# Altium schematic sheet 无人驾驶车ECUV3.SchDoc
size A2
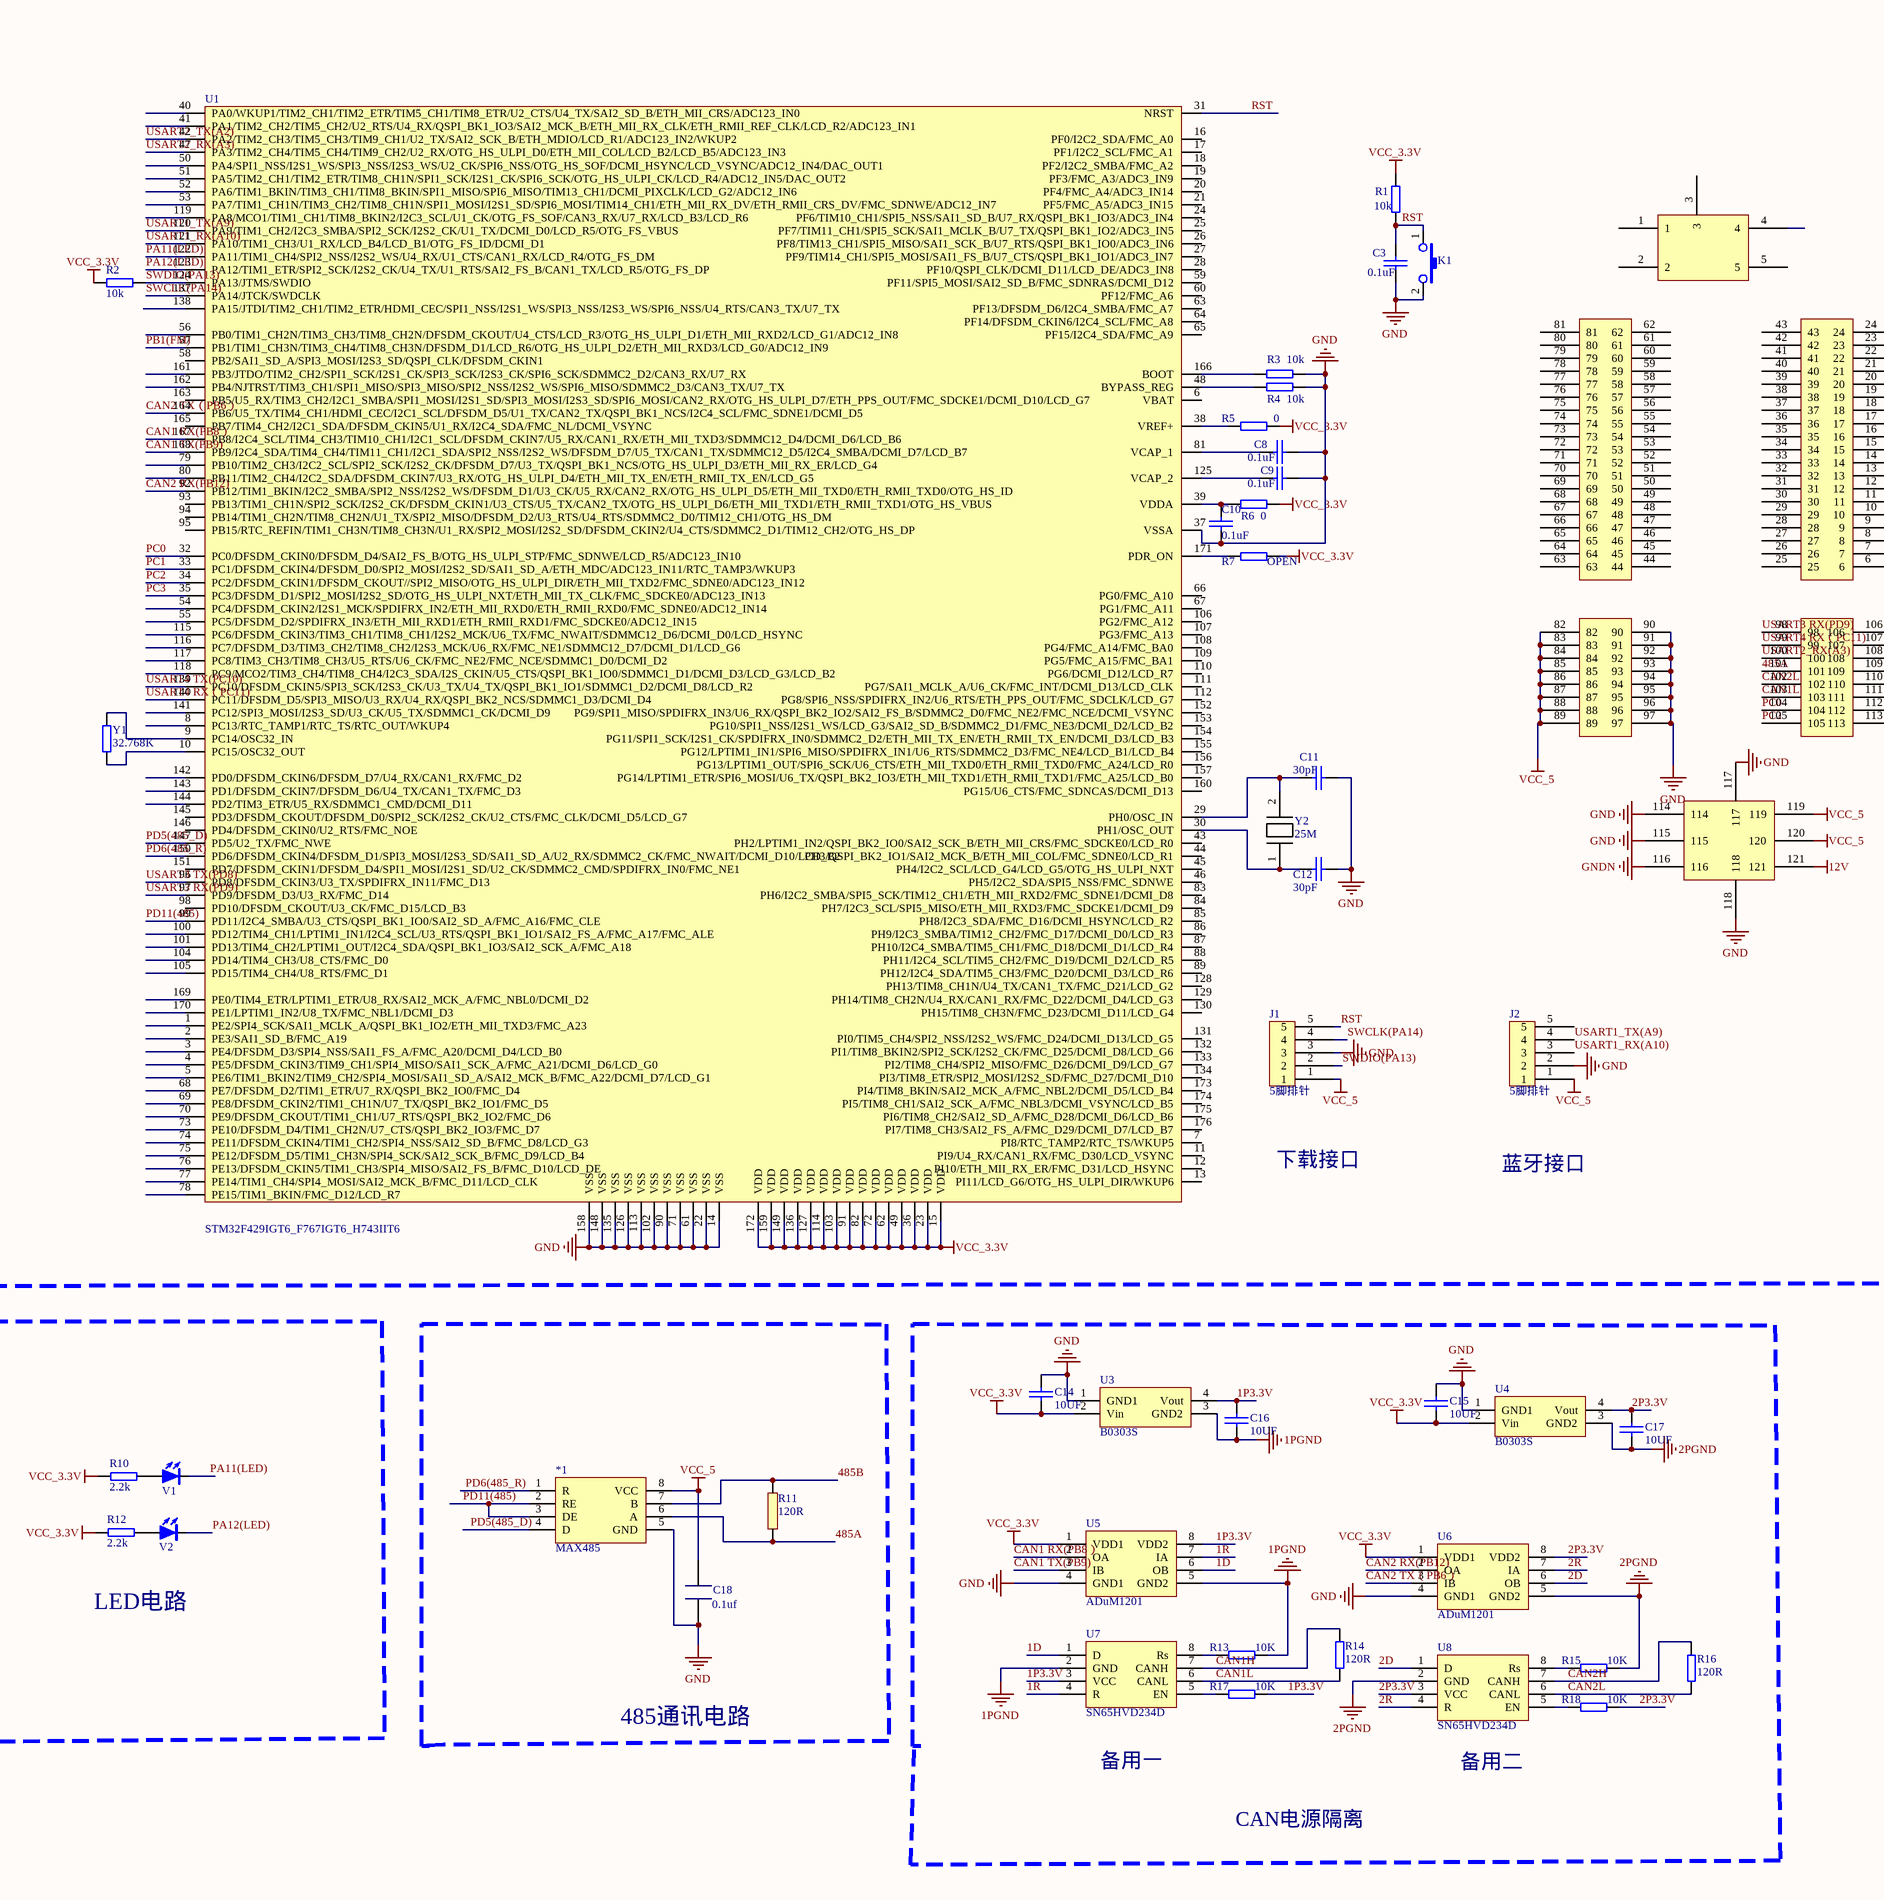
[diagram p0: 无人驾驶车ECUV3.SchDoc, left]
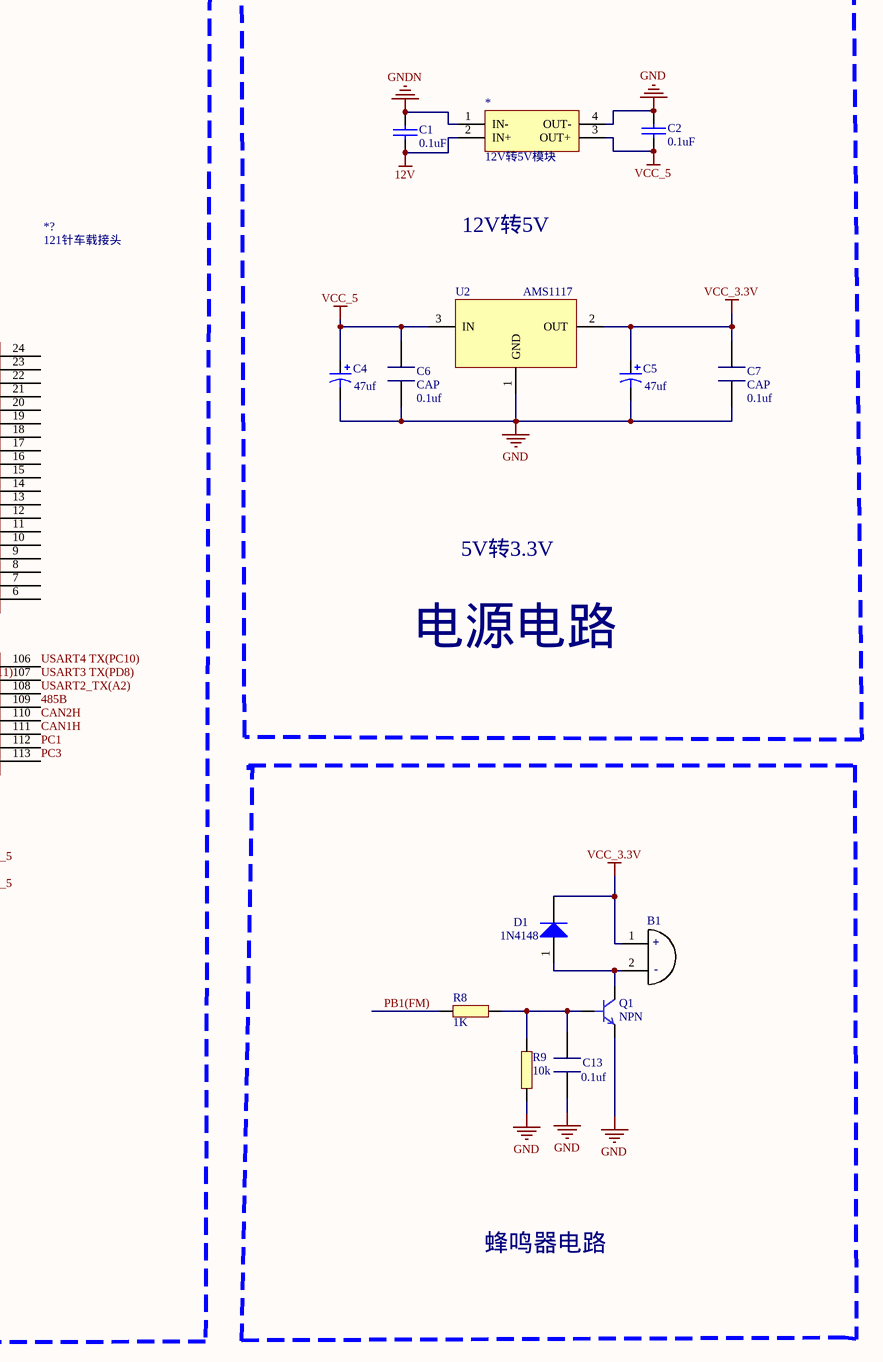
[diagram p1: 无人驾驶车ECUV3.SchDoc, right]

## Parts
*  12V转5V模块  [12V转5V模块]
*1  MAX485  [SOP127P600X175-8N]
*?  121针车载接头  [121针车载接头]
B1  Buzzer  [Buzzer_0905_9*5.5mm]  (value not drawn)
C1  0.1uF  [0805_C_M]
C2  0.1uF  [0805_C_M]
C3  0.1uF  [0805_c_m]
C4  CAP_POL  [CAPC_1206]  (value not drawn)
C5  CAP_POL  [CAPC_1206]  (value not drawn)
C6  CAP  value 0.1uf  [CAPC_0603_2]
C7  CAP  value 0.1uf  [CAPC_0603_2]
C8  0.1uF  [0805_C_M]
C9  0.1uF  [0805_C_M]
C10  0.1uF  [0805_c_m]
C11  30pF  [0805_C_M]
C12  30pF  [0805_C_M]
C13  value 0.1uf  [CAPC_0603_2]  (hidden comment: CAP)
C14  10UF  [SMT_C_0603]
C15  10UF  [SMT_C_0603]
C16  10UF  [SMT_C_0603]
C17  10UF  [SMT_C_0603]
C18  value 0.1uf  [CAPC_0603_2]  (hidden comment: CAP)
D1  1N4148  [SOD_80]
J1  5脚排针  [5脚排针]
J2  5脚排针  [5脚排针]
K1  KEY1  [KEY4]  (value not drawn)
Q1  NPN  [SOT23_3]
R1  10k  [0805_R_M]
R2  10k  [0805_R_M]
R3  10k  [0805_R_M]
R4  10k  [0805_R_M]
R5  0  [0805_R_M]
R6  0  [0805_R_M]
R7  OPEN  [0805_R_M]
R8  value 1K  [RESC_0603_2]  (hidden comment: RES)
R9  value 10k  [RESC_0603_2]  (hidden comment: RES)
R10  2.2k  [0805_R_M]
R11  value 120R  [RESC_0603_2]  (hidden comment: RES)
R12  2.2k  [0805_R_M]
R13  10K  [SMT_R_0402]
R14  120R  [SMT_R_0402]
R15  10K  [SMT_R_0402]
R16  120R  [SMT_R_0402]
R17  10K  [SMT_R_0402]
R18  10K  [SMT_R_0402]
U1  STM32F429IGT6_F767IGT6_H743IIT6  [LQFP176]
U2  AMS1117  [SOT223-AMS1117]
U3  B0303S  [BXXXXS]
U4  B0303S  [BXXXXS]
U5  ADuM1201  [SOP-8_M]
U6  ADuM1201  [SOP-8_M]
U7  SN65HVD234D  [SOP-8_M]
U8  SN65HVD234D  [SOP-8_M]
V1  LED  [0805D]  (value not drawn)
V2  LED  [0805D]  (value not drawn)
Y1  32.768K  [0805_C_M]
Y2  25M  [XTAL_SMD_49S]

## Blocks framed on the sheet
电源电路: * C1 C2 C4-C7 U2

## Nets
1PGND: C16.2 R13.2 U3.3(GND2) U5.5(GND2) U7.2(GND)
2PGND: C17.2 R15.2 U4.3(GND2) U6.5(GND2) U8.2(GND)
12V: *.2(IN+) *?.121 C1.2
GND: *.4(OUT-) *1.5(GND) *?.90 *?.91 *?.92 *?.93 *?.94 *?.95 *?.96 *?.97 *?.114 *?.115 *?.117 *?.118 C2.1 C3.1 C4.2 C5.2 C6.1 C7.1 C8.1 C9.1 C10.2 C11.2 C12.2 C13.1 C14.1 C15.1 C18.1 J1.3 J2.2 K1.2 Q1.2 R3.1 R4.1 R9.1 U1.14(VSS) U1.22(VSS) U1.37(VSSA) U1.61(VSS) U1.71(VSS) U1.90(VSS) U1.102(VSS) U1.113(VSS) U1.126(VSS) U1.135(VSS) U1.148(VSS) U1.158(VSS) U2.1(GND) U3.1(GND1) U4.1(GND1) U5.4(GND1) U6.4(GND1)
GNDN: *.1(IN-) *?.116 C1.1
VCC_3.3V: B1.1 C5.1 C7.2 C14.2 C15.2 D1.2(K) R1.2 R2.2 R5.1 R6.1 R7.1 R10.2 R12.2 U1.15(VDD) U1.23(VDD) U1.36(VDD) U1.49(VDD) U1.62(VDD) U1.72(VDD) U1.82(VDD) U1.91(VDD) U1.103(VDD) U1.114(VDD) U1.127(VDD) U1.136(VDD) U1.149(VDD) U1.159(VDD) U1.172(VDD) U2.2(OUT) U3.2(Vin) U4.2(Vin) U5.1(VDD1) U6.1(VDD1)
VCC_5: *.3(OUT+) *1.8(VCC) *?.82 *?.83 *?.84 *?.85 *?.86 *?.87 *?.88 *?.89 *?.119 *?.120 C2.2 C4.1 C6.2 C18.2 J1.1 J2.1 U2.3(IN)
1D: U5.6(OB) U7.1(D)
1P3.3V: C16.1 R17.2 U3.4(Vout) U5.8(VDD2) U7.3(VCC)
1R: U5.7(IA) U7.4(R)
2D: U6.6(OB) U8.1(D)
2P3.3V: C17.1 R18.2 U4.4(Vout) U6.8(VDD2) U8.3(VCC)
2R: U6.7(IA) U8.4(R)
485A: *1.6(A) *?.101 R11.1
485B: *1.7(B) *?.109 R11.2
CAN1 RX(PB8）: U1.167(PB8/I2C4_SCL/TIM4_CH3/TIM10_CH1/I2C1_SCL/DFSDM_CKIN7/U5_RX/CAN1_RX/ETH_MII_TXD3/SDMMC12_D4/DCMI_D6/LCD_B6) U5.2(OA)
CAN1 TX(PB9): U1.168(PB9/I2C4_SDA/TIM4_CH4/TIM11_CH1/I2C1_SDA/SPI2_NSS/I2S2_WS/DFSDM_D7/U5_TX/CAN1_TX/SDMMC12_D5/I2C4_SMBA/DCMI_D7/LCD_B7) U5.3(IB)
CAN1H: *?.111 R14.2 U7.7(CANH)
CAN1L: *?.103 R14.1 U7.6(CANL)
CAN2 RX(PB12): U1.92(PB12/TIM1_BKIN/I2C2_SMBA/SPI2_NSS/I2S2_WS/DFSDM_D1/U3_CK/U5_RX/CAN2_RX/OTG_HS_ULPI_D5/ETH_MII_TXD0/ETH_RMII_TXD0/OTG_HS_ID) U6.2(OA)
CAN2 TX（PB6）: U1.164(PB6/U5_TX/TIM4_CH1/HDMI_CEC/I2C1_SCL/DFSDM_D5/U1_TX/CAN2_TX/QSPI_BK1_NCS/I2C4_SCL/FMC_SDNE1/DCMI_D5) U6.3(IB)
CAN2H: *?.110 R16.2 U8.7(CANH)
CAN2L: *?.102 R16.1 U8.6(CANL)
PA11(LED): U1.122(PA11/TIM1_CH4/SPI2_NSS/I2S2_WS/U4_RX/U1_CTS/CAN1_RX/LCD_R4/OTG_FS_DM) V1.2
PA12(LED): U1.123(PA12/TIM1_ETR/SPI2_SCK/I2S2_CK/U4_TX/U1_RTS/SAI2_FS_B/CAN1_TX/LCD_R5/OTG_FS_DP) V2.2
PB1(FM): R8.1 U1.57(PB1/TIM1_CH3N/TIM3_CH4/TIM8_CH3N/DFSDM_D1/LCD_R6/OTG_HS_ULPI_D2/ETH_MII_RXD3/LCD_G0/ADC12_IN9)
PC0: *?.104 U1.32(PC0/DFSDM_CKIN0/DFSDM_D4/SAI2_FS_B/OTG_HS_ULPI_STP/FMC_SDNWE/LCD_R5/ADC123_IN10)
PC1: *?.112 U1.33(PC1/DFSDM_CKIN4/DFSDM_D0/SPI2_MOSI/I2S2_SD/SAI1_SD_A/ETH_MDC/ADC123_IN11/RTC_TAMP3/WKUP3)
PC2: *?.105 U1.34(PC2/DFSDM_CKIN1/DFSDM_CKOUT//SPI2_MISO/OTG_HS_ULPI_DIR/ETH_MII_TXD2/FMC_SDNE0/ADC123_IN12)
PC3: *?.113 U1.35(PC3/DFSDM_D1/SPI2_MOSI/I2S2_SD/OTG_HS_ULPI_NXT/ETH_MII_TX_CLK/FMC_SDCKE0/ADC123_IN13)
PD5(485_D): *1.4(D) U1.147(PD5/U2_TX/FMC_NWE)
PD6(485_R): *1.1(R) U1.150(PD6/DFSDM_CKIN4/DFSDM_D1/SPI3_MOSI/I2S3_SD/SAI1_SD_A/U2_RX/SDMMC2_CK/FMC_NWAIT/DCMI_D10/LCD_B2)
PD11(485): *1.2(RE) *1.3(DE) U1.99(PD11/I2C4_SMBA/U3_CTS/QSPI_BK1_IO0/SAI2_SD_A/FMC_A16/FMC_CLE)
RST: C3.2 J1.5 K1.1 R1.1 U1.31(NRST)
SWCLK(PA14): J1.4 U1.137(PA14/JTCK/SWDCLK)
SWDIO(PA13): J1.2 R2.1 U1.124(PA13/JTMS/SWDIO)
USART1_RX(A10): J2.3 U1.121(PA10/TIM1_CH3/U1_RX/LCD_B4/LCD_B1/OTG_FS_ID/DCMI_D1)
USART1_TX(A9): J2.4 U1.120(PA9/TIM1_CH2/I2C3_SMBA/SPI2_SCK/I2S2_CK/U1_TX/DCMI_D0/LCD_R5/OTG_FS_VBUS)
USART2_RX(A3): *?.100 U1.47(PA3/TIM2_CH4/TIM5_CH4/TIM9_CH2/U2_RX/OTG_HS_ULPI_D0/ETH_MII_COL/LCD_B2/LCD_B5/ADC123_IN3)
USART2_TX(A2): *?.108 U1.42(PA2/TIM2_CH3/TIM5_CH3/TIM9_CH1/U2_TX/SAI2_SCK_B/ETH_MDIO/LCD_R1/ADC123_IN2/WKUP2)
USART3 RX(PD9): *?.98 U1.97(PD9/DFSDM_D3/U3_RX/FMC_D14)
USART3 TX(PD8): *?.107 U1.96(PD8/DFSDM_CKIN3/U3_TX/SPDIFRX_IN11/FMC_D13)
USART4 RX（PC11): *?.99 U1.140(PC11/DFSDM_D5/SPI3_MISO/U3_RX/U4_RX/QSPI_BK2_NCS/SDMMC1_D3/DCMI_D4)
USART4 TX(PC10): *?.106 U1.139(PC10/DFSDM_CKIN5/SPI3_SCK/I2S3_CK/U3_TX/U4_TX/QSPI_BK1_IO1/SDMMC1_D2/DCMI_D8/LCD_R2)
NetB1_2: B1.2 D1.1(A) Q1.3
NetC8_2: C8.2 U1.81(VCAP_1)
NetC9_2: C9.2 U1.125(VCAP_2)
NetC10_1: C10.1 R6.2 U1.39(VDDA)
NetC11_1: C11.1 U1.29(PH0/OSC_IN) Y2.2
NetC12_1: C12.1 U1.30(PH1/OSC_OUT) Y2.1
NetC13_2: C13.2 Q1.1 R8.2 R9.2
NetR3_2: R3.2 U1.166(BOOT)
NetR4_2: R4.2 U1.48(BYPASS_REG)
NetR5_2: R5.2 U1.38(VREF+)
NetR7_2: R7.2 U1.171(PDR_ON)
NetR10_1: R10.1 V1.1
NetR12_1: R12.1 V2.1
NetR13_1: R13.1 U7.8(Rs)
NetR15_1: R15.1 U8.8(Rs)
NetR17_1: R17.1 U7.5(EN)
NetR18_1: R18.1 U8.5(EN)
NetU1_9: U1.9(PC14/OSC32_IN) Y1.2
NetU1_10: U1.10(PC15/OSC32_OUT) Y1.1

Not connected (* = marked no-connect by the designer): *? 1 2 3 4 5 6 7 8 9 10 11 12 13 14 15 16 17 18 19 20 21 22 23 24 25 26 27 28 29 30 31 32 33 34 35 36 37 38 39 40 41 42 43 44 45 46 47 48 49 50 51 52 53 54 55 56 57 58 59 60 61 62 63 64 65 66 67 68 69 70 71 72 73 74 75 76 77 78 79 80 81; J2 5; U1 1(PE2/SPI4_SCK/SAI1_MCLK_A/QSPI_BK1_IO2/ETH_MII_TXD3/FMC_A23) 2(PE3/SAI1_SD_B/FMC_A19) 3(PE4/DFSDM_D3/SPI4_NSS/SAI1_FS_A/FMC_A20/DCMI_D4/LCD_B0) 4(PE5/DFSDM_CKIN3/TIM9_CH1/SPI4_MISO/SAI1_SCK_A/FMC_A21/DCMI_D6/LCD_G0) 5(PE6/TIM1_BKIN2/TIM9_CH2/SPI4_MOSI/SAI1_SD_A/SAI2_MCK_B/FMC_A22/DCMI_D7/LCD_G1) 6(VBAT) 7(PI8/RTC_TAMP2/RTC_TS/WKUP5) 8(PC13/RTC_TAMP1/RTC_TS/RTC_OUT/WKUP4) 11(PI9/U4_RX/CAN1_RX/FMC_D30/LCD_VSYNC) 12(PI10/ETH_MII_RX_ER/FMC_D31/LCD_HSYNC) 13(PI11/LCD_G6/OTG_HS_ULPI_DIR/WKUP6) 16(PF0/I2C2_SDA/FMC_A0) 17(PF1/I2C2_SCL/FMC_A1) 18(PF2/I2C2_SMBA/FMC_A2) 19(PF3/FMC_A3/ADC3_IN9) 20(PF4/FMC_A4/ADC3_IN14) 21(PF5/FMC_A5/ADC3_IN15) 24(PF6/TIM10_CH1/SPI5_NSS/SAI1_SD_B/U7_RX/QSPI_BK1_IO3/ADC3_IN4) 25(PF7/TIM11_CH1/SPI5_SCK/SAI1_MCLK_B/U7_TX/QSPI_BK1_IO2/ADC3_IN5) 26(PF8/TIM13_CH1/SPI5_MISO/SAI1_SCK_B/U7_RTS/QSPI_BK1_IO0/ADC3_IN6) 27(PF9/TIM14_CH1/SPI5_MOSI/SAI1_FS_B/U7_CTS/QSPI_BK1_IO1/ADC3_IN7) 28(PF10/QSPI_CLK/DCMI_D11/LCD_DE/ADC3_IN8) 40(PA0/WKUP1/TIM2_CH1/TIM2_ETR/TIM5_CH1/TIM8_ETR/U2_CTS/U4_TX/SAI2_SD_B/ETH_MII_CRS/ADC123_IN0) 41(PA1/TIM2_CH2/TIM5_CH2/U2_RTS/U4_RX/QSPI_BK1_IO3/SAI2_MCK_B/ETH_MII_RX_CLK/ETH_RMII_REF_CLK/LCD_R2/ADC123_IN1) 43(PH2/LPTIM1_IN2/QSPI_BK2_IO0/SAI2_SCK_B/ETH_MII_CRS/FMC_SDCKE0/LCD_R0) 44(PH3/QSPI_BK2_IO1/SAI2_MCK_B/ETH_MII_COL/FMC_SDNE0/LCD_R1) 45(PH4/I2C2_SCL/LCD_G4/LCD_G5/OTG_HS_ULPI_NXT) 46(PH5/I2C2_SDA/SPI5_NSS/FMC_SDNWE) 50(PA4/SPI1_NSS/I2S1_WS/SPI3_NSS/I2S3_WS/U2_CK/SPI6_NSS/OTG_HS_SOF/DCMI_HSYNC/LCD_VSYNC/ADC12_IN4/DAC_OUT1) 51(PA5/TIM2_CH1/TIM2_ETR/TIM8_CH1N/SPI1_SCK/I2S1_CK/SPI6_SCK/OTG_HS_ULPI_CK/LCD_R4/ADC12_IN5/DAC_OUT2) 52(PA6/TIM1_BKIN/TIM3_CH1/TIM8_BKIN/SPI1_MISO/SPI6_MISO/TIM13_CH1/DCMI_PIXCLK/LCD_G2/ADC12_IN6) 53(PA7/TIM1_CH1N/TIM3_CH2/TIM8_CH1N/SPI1_MOSI/I2S1_SD/SPI6_MOSI/TIM14_CH1/ETH_MII_RX_DV/ETH_RMII_CRS_DV/FMC_SDNWE/ADC12_IN7) 54(PC4/DFSDM_CKIN2/I2S1_MCK/SPDIFRX_IN2/ETH_MII_RXD0/ETH_RMII_RXD0/FMC_SDNE0/ADC12_IN14) 55(PC5/DFSDM_D2/SPDIFRX_IN3/ETH_MII_RXD1/ETH_RMII_RXD1/FMC_SDCKE0/ADC12_IN15) 56(PB0/TIM1_CH2N/TIM3_CH3/TIM8_CH2N/DFSDM_CKOUT/U4_CTS/LCD_R3/OTG_HS_ULPI_D1/ETH_MII_RXD2/LCD_G1/ADC12_IN8) 58(PB2/SAI1_SD_A/SPI3_MOSI/I2S3_SD/QSPI_CLK/DFSDM_CKIN1) 59(PF11/SPI5_MOSI/SAI2_SD_B/FMC_SDNRAS/DCMI_D12) 60(PF12/FMC_A6) 63(PF13/DFSDM_D6/I2C4_SMBA/FMC_A7) 64(PF14/DFSDM_CKIN6/I2C4_SCL/FMC_A8) 65(PF15/I2C4_SDA/FMC_A9) 66(PG0/FMC_A10) 67(PG1/FMC_A11) 68(PE7/DFSDM_D2/TIM1_ETR/U7_RX/QSPI_BK2_IO0/FMC_D4) 69(PE8/DFSDM_CKIN2/TIM1_CH1N/U7_TX/QSPI_BK2_IO1/FMC_D5) 70(PE9/DFSDM_CKOUT/TIM1_CH1/U7_RTS/QSPI_BK2_IO2/FMC_D6) 73(PE10/DFSDM_D4/TIM1_CH2N/U7_CTS/QSPI_BK2_IO3/FMC_D7) 74(PE11/DFSDM_CKIN4/TIM1_CH2/SPI4_NSS/SAI2_SD_B/FMC_D8/LCD_G3) 75(PE12/DFSDM_D5/TIM1_CH3N/SPI4_SCK/SAI2_SCK_B/FMC_D9/LCD_B4) 76(PE13/DFSDM_CKIN5/TIM1_CH3/SPI4_MISO/SAI2_FS_B/FMC_D10/LCD_DE) 77(PE14/TIM1_CH4/SPI4_MOSI/SAI2_MCK_B/FMC_D11/LCD_CLK) 78(PE15/TIM1_BKIN/FMC_D12/LCD_R7) 79(PB10/TIM2_CH3/I2C2_SCL/SPI2_SCK/I2S2_CK/DFSDM_D7/U3_TX/QSPI_BK1_NCS/OTG_HS_ULPI_D3/ETH_MII_RX_ER/LCD_G4) 80(PB11/TIM2_CH4/I2C2_SDA/DFSDM_CKIN7/U3_RX/OTG_HS_ULPI_D4/ETH_MII_TX_EN/ETH_RMII_TX_EN/LCD_G5) 83(PH6/I2C2_SMBA/SPI5_SCK/TIM12_CH1/ETH_MII_RXD2/FMC_SDNE1/DCMI_D8) 84(PH7/I2C3_SCL/SPI5_MISO/ETH_MII_RXD3/FMC_SDCKE1/DCMI_D9) 85(PH8/I2C3_SDA/FMC_D16/DCMI_HSYNC/LCD_R2) 86(PH9/I2C3_SMBA/TIM12_CH2/FMC_D17/DCMI_D0/LCD_R3) 87(PH10/I2C4_SMBA/TIM5_CH1/FMC_D18/DCMI_D1/LCD_R4) 88(PH11/I2C4_SCL/TIM5_CH2/FMC_D19/DCMI_D2/LCD_R5) 89(PH12/I2C4_SDA/TIM5_CH3/FMC_D20/DCMI_D3/LCD_R6) 93(PB13/TIM1_CH1N/SPI2_SCK/I2S2_CK/DFSDM_CKIN1/U3_CTS/U5_TX/CAN2_TX/OTG_HS_ULPI_D6/ETH_MII_TXD1/ETH_RMII_TXD1/OTG_HS_VBUS) 94(PB14/TIM1_CH2N/TIM8_CH2N/U1_TX/SPI2_MISO/DFSDM_D2/U3_RTS/U4_RTS/SDMMC2_D0/TIM12_CH1/OTG_HS_DM) 95(PB15/RTC_REFIN/TIM1_CH3N/TIM8_CH3N/U1_RX/SPI2_MOSI/I2S2_SD/DFSDM_CKIN2/U4_CTS/SDMMC2_D1/TIM12_CH2/OTG_HS_DP) 98(PD10/DFSDM_CKOUT/U3_CK/FMC_D15/LCD_B3) 100(PD12/TIM4_CH1/LPTIM1_IN1/I2C4_SCL/U3_RTS/QSPI_BK1_IO1/SAI2_FS_A/FMC_A17/FMC_ALE) 101(PD13/TIM4_CH2/LPTIM1_OUT/I2C4_SDA/QSPI_BK1_IO3/SAI2_SCK_A/FMC_A18) 104(PD14/TIM4_CH3/U8_CTS/FMC_D0) 105(PD15/TIM4_CH4/U8_RTS/FMC_D1) 106(PG2/FMC_A12) 107(PG3/FMC_A13) 108(PG4/FMC_A14/FMC_BA0) 109(PG5/FMC_A15/FMC_BA1) 110(PG6/DCMI_D12/LCD_R7) 111(PG7/SAI1_MCLK_A/U6_CK/FMC_INT/DCMI_D13/LCD_CLK) 112(PG8/SPI6_NSS/SPDIFRX_IN2/U6_RTS/ETH_PPS_OUT/FMC_SDCLK/LCD_G7) 115(PC6/DFSDM_CKIN3/TIM3_CH1/TIM8_CH1/I2S2_MCK/U6_TX/FMC_NWAIT/SDMMC12_D6/DCMI_D0/LCD_HSYNC) 116(PC7/DFSDM_D3/TIM3_CH2/TIM8_CH2/I2S3_MCK/U6_RX/FMC_NE1/SDMMC12_D7/DCMI_D1/LCD_G6) 117(PC8/TIM3_CH3/TIM8_CH3/U5_RTS/U6_CK/FMC_NE2/FMC_NCE/SDMMC1_D0/DCMI_D2) 118(PC9/MCO2/TIM3_CH4/TIM8_CH4/I2C3_SDA/I2S_CKIN/U5_CTS/QSPI_BK1_IO0/SDMMC1_D1/DCMI_D3/LCD_G3/LCD_B2) 119(PA8/MCO1/TIM1_CH1/TIM8_BKIN2/I2C3_SCL/U1_CK/OTG_FS_SOF/CAN3_RX/U7_RX/LCD_B3/LCD_R6) 128(PH13/TIM8_CH1N/U4_TX/CAN1_TX/FMC_D21/LCD_G2) 129(PH14/TIM8_CH2N/U4_RX/CAN1_RX/FMC_D22/DCMI_D4/LCD_G3) 130(PH15/TIM8_CH3N/FMC_D23/DCMI_D11/LCD_G4) 131(PI0/TIM5_CH4/SPI2_NSS/I2S2_WS/FMC_D24/DCMI_D13/LCD_G5) 132(PI1/TIM8_BKIN2/SPI2_SCK/I2S2_CK/FMC_D25/DCMI_D8/LCD_G6) 133(PI2/TIM8_CH4/SPI2_MISO/FMC_D26/DCMI_D9/LCD_G7) 134(PI3/TIM8_ETR/SPI2_MOSI/I2S2_SD/FMC_D27/DCMI_D10) 138(PA15/JTDI/TIM2_CH1/TIM2_ETR/HDMI_CEC/SPI1_NSS/I2S1_WS/SPI3_NSS/I2S3_WS/SPI6_NSS/U4_RTS/CAN3_TX/U7_TX) 141(PC12/SPI3_MOSI/I2S3_SD/U3_CK/U5_TX/SDMMC1_CK/DCMI_D9) 142(PD0/DFSDM_CKIN6/DFSDM_D7/U4_RX/CAN1_RX/FMC_D2) 143(PD1/DFSDM_CKIN7/DFSDM_D6/U4_TX/CAN1_TX/FMC_D3) 144(PD2/TIM3_ETR/U5_RX/SDMMC1_CMD/DCMI_D11) 145(PD3/DFSDM_CKOUT/DFSDM_D0/SPI2_SCK/I2S2_CK/U2_CTS/FMC_CLK/DCMI_D5/LCD_G7) 146(PD4/DFSDM_CKIN0/U2_RTS/FMC_NOE) 151(PD7/DFSDM_CKIN1/DFSDM_D4/SPI1_MOSI/I2S1_SD/U2_CK/SDMMC2_CMD/SPDIFRX_IN0/FMC_NE1) 152(PG9/SPI1_MISO/SPDIFRX_IN3/U6_RX/QSPI_BK2_IO2/SAI2_FS_B/SDMMC2_D0/FMC_NE2/FMC_NCE/DCMI_VSYNC) 153(PG10/SPI1_NSS/I2S1_WS/LCD_G3/SAI2_SD_B/SDMMC2_D1/FMC_NE3/DCMI_D2/LCD_B2) 154(PG11/SPI1_SCK/I2S1_CK/SPDIFRX_IN0/SDMMC2_D2/ETH_MII_TX_EN/ETH_RMII_TX_EN/DCMI_D3/LCD_B3) 155(PG12/LPTIM1_IN1/SPI6_MISO/SPDIFRX_IN1/U6_RTS/SDMMC2_D3/FMC_NE4/LCD_B1/LCD_B4) 156(PG13/LPTIM1_OUT/SPI6_SCK/U6_CTS/ETH_MII_TXD0/ETH_RMII_TXD0/FMC_A24/LCD_R0) 157(PG14/LPTIM1_ETR/SPI6_MOSI/U6_TX/QSPI_BK2_IO3/ETH_MII_TXD1/ETH_RMII_TXD1/FMC_A25/LCD_B0) 160(PG15/U6_CTS/FMC_SDNCAS/DCMI_D13) 161(PB3/JTDO/TIM2_CH2/SPI1_SCK/I2S1_CK/SPI3_SCK/I2S3_CK/SPI6_SCK/SDMMC2_D2/CAN3_RX/U7_RX) 162(PB4/NJTRST/TIM3_CH1/SPI1_MISO/SPI3_MISO/SPI2_NSS/I2S2_WS/SPI6_MISO/SDMMC2_D3/CAN3_TX/U7_TX) 163(PB5/U5_RX/TIM3_CH2/I2C1_SMBA/SPI1_MOSI/I2S1_SD/SPI3_MOSI/I2S3_SD/SPI6_MOSI/CAN2_RX/OTG_HS_ULPI_D7/ETH_PPS_OUT/FMC_SDCKE1/DCMI_D10/LCD_G7) 165(PB7/TIM4_CH2/I2C1_SDA/DFSDM_CKIN5/U1_RX/I2C4_SDA/FMC_NL/DCMI_VSYNC) 169(PE0/TIM4_ETR/LPTIM1_ETR/U8_RX/SAI2_MCK_A/FMC_NBL0/DCMI_D2) 170(PE1/LPTIM1_IN2/U8_TX/FMC_NBL1/DCMI_D3) 173(PI4/TIM8_BKIN/SAI2_MCK_A/FMC_NBL2/DCMI_D5/LCD_B4) 174(PI5/TIM8_CH1/SAI2_SCK_A/FMC_NBL3/DCMI_VSYNC/LCD_B5) 175(PI6/TIM8_CH2/SAI2_SD_A/FMC_D28/DCMI_D6/LCD_B6) 176(PI7/TIM8_CH3/SAI2_FS_A/FMC_D29/DCMI_D7/LCD_B7)

## Notes on the sheet
- 12V转5V
- 5V转3.3V
- 下载接口
- 蓝牙接口
- 蜂鸣器电路
- LED电路
- 485通讯电路
- 备用一
- (near U8) 备用二
- CAN电源隔离
- (in symbol Buzzer) +; -
- (in symbol CAP_POL) 47uf

## Library data of the parts
C1-C3 C8-C12 = C1: 0.1: *; 0.01: *; 0.47: *; 0.22: *; 0.022: *; 2.2n: *; 1n: *
C4 C5 = CAP_POL: 有极性电容
C6 C7 C13 C18 = CAP: 电容
C14-C17 = SMT_C
D1 = Diode 1N4148: High Conductance Fast Diode; Published: 8-Jun-2000; LatestRevisionDate: 17-Jul-2002; LatestRevisionNote: Re-released for DXP Platform.; DatasheetVersion: 1997; PackageReference: DO-35; Publisher: Altium Limited; PackageDescription: Diode, Axial; Body 3.8 x 1.9 mm (LxDia. max), Lead Dia. 0.53 mm (max); Code_JEDEC: DO-204-AH; ComponentLink1Description: Manufacturer Link; ComponentLink1URL: http://www.fairchildsemi.com/; ComponentLink2Description: Datasheet; ComponentLink2URL: http://www.fairchildsemi.com/ds/1N%2F1N4148.pdf
Q1 = NPN: 三极管
R1-R7 R10 R12 Y1 = R1
R8 R9 R11 = RES: 电阻
R13-R18 = SMT_R
U1 = STM32F767IGT6
U2 = AMS1117: 电源芯片_5V-3.3v
V1 V2 = LED2
Y2 = XTAL: 晶振